# EAGLE schematic GB202-CC-from-SF-Base (EAGLE 7.5.0)
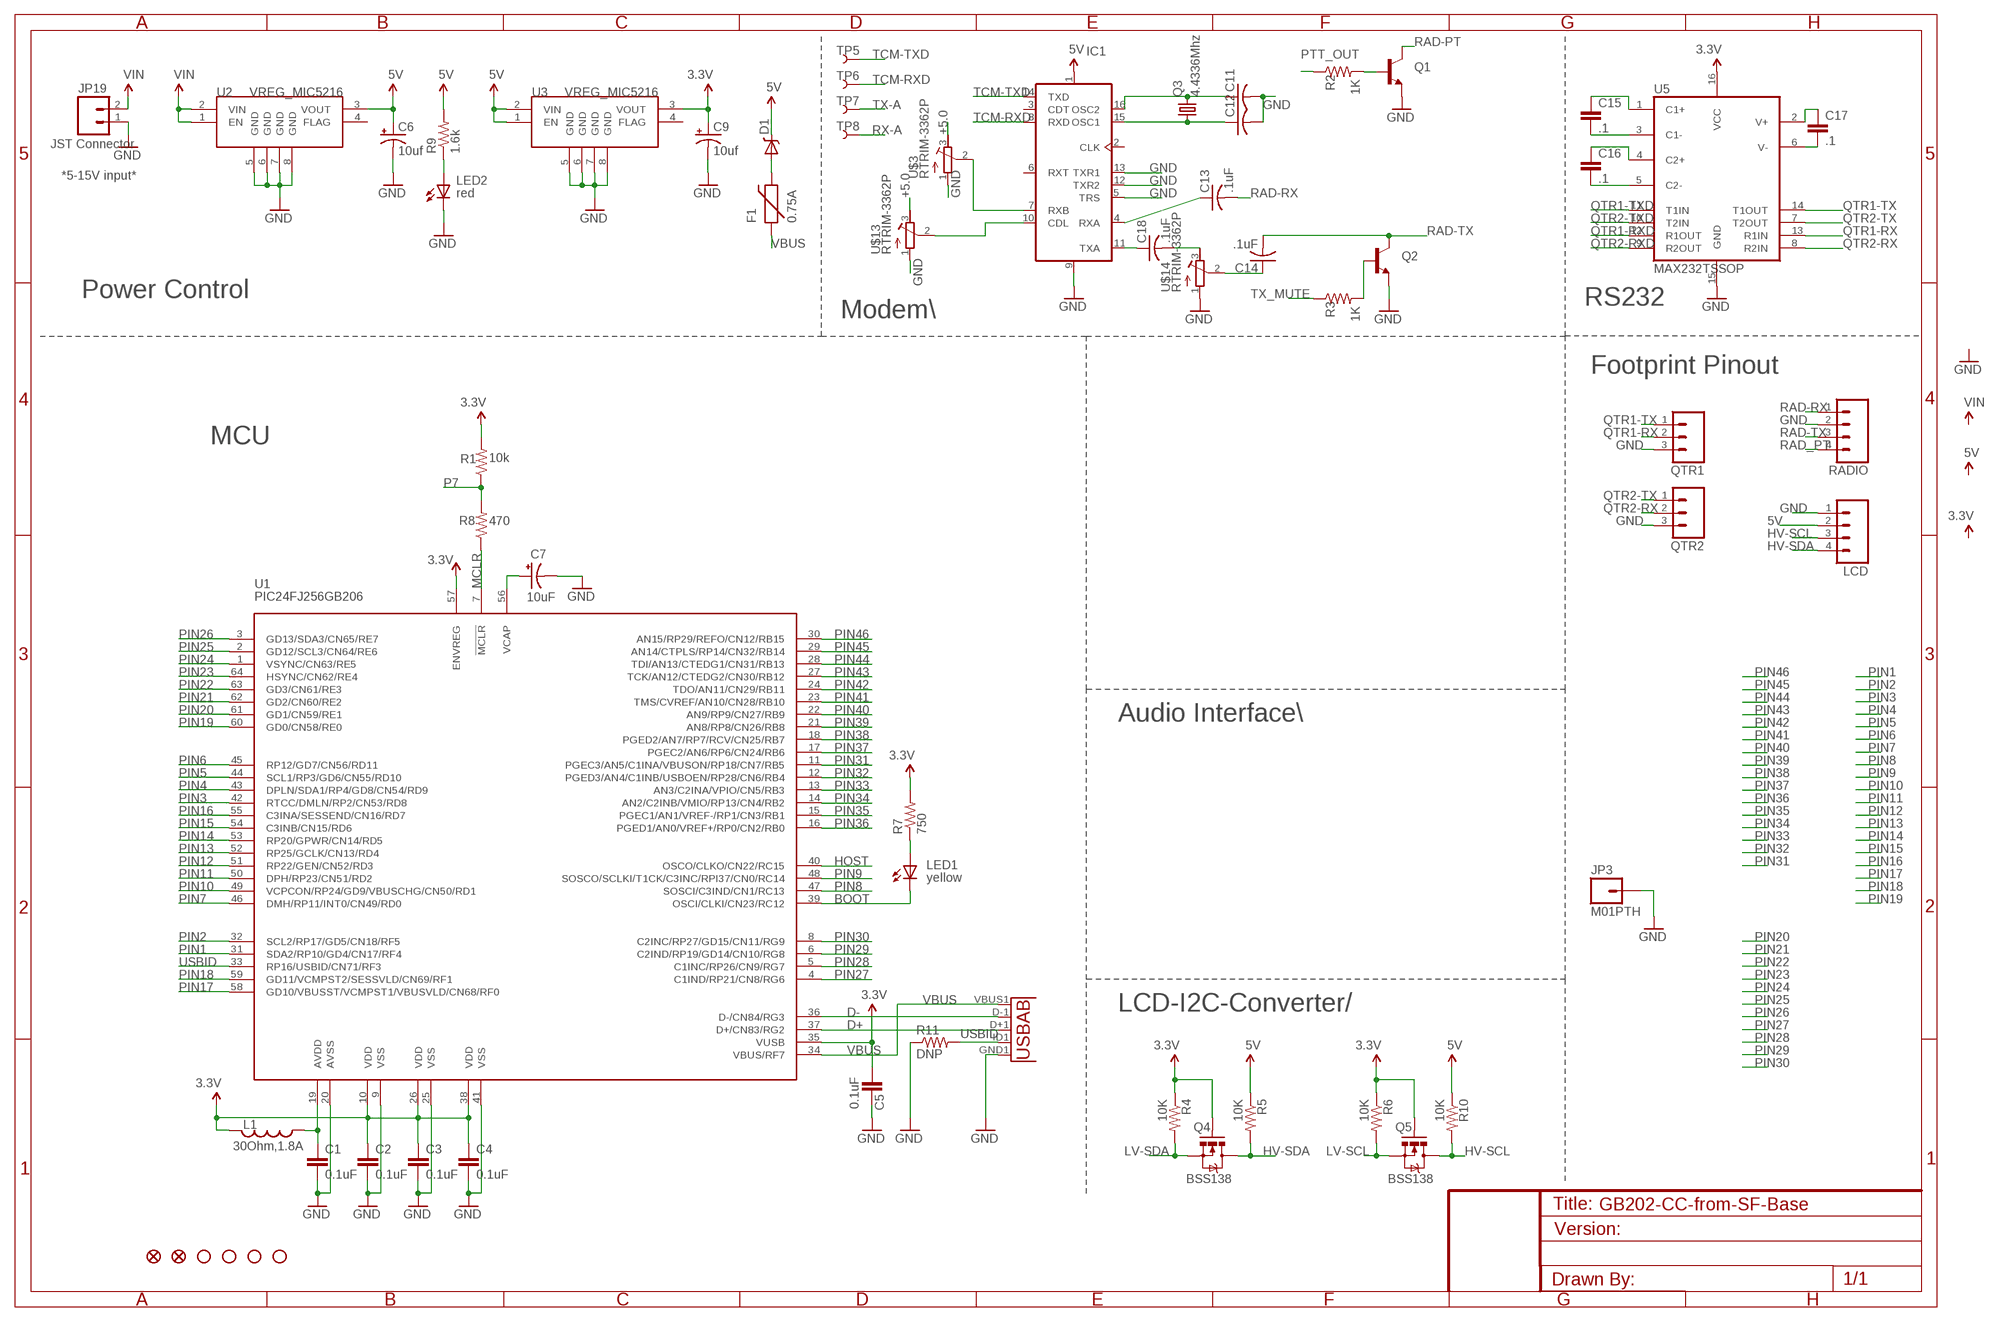
[diagram p0: schematic, sheet 1]

## Parts
C1  0.1uF  CAP0603-CAP  [0603-CAP]
C2  0.1uF  CAP0603-CAP  [0603-CAP]
C3  0.1uF  CAP0603-CAP  [0603-CAP]
C4  0.1uF  CAP0603-CAP  [0603-CAP]
C5  0.1uF  CAP0603-CAP  [0603-CAP]
C6  10uf  CAP_POL1206  [EIA3216]
C7  10uF  CAP_POL1206  [EIA3216]
C9  10uf  CAP_POL1206  [EIA3216]
C11  C-USC0603  [C0603]
C12  C-USC0603  [C0603]
C13  .1uF  C-USC0603  [C0603]
C14  .1uF  C-USC0603  [C0603]
C15  .1  CAPPTH  [CAP-PTH-SMALL]
C16  .1  CAPPTH  [CAP-PTH-SMALL]
C17  .1  CAPPTH  [CAP-PTH-SMALL]
C18  .1uF  C-USC0603  [C0603]
D1  DIODE-SCHOTTKY_  [SMA-DIODE]
F1  PTCSMD  [PTC-1206]
IC1  TCM3105  [DIL16]
JP3  M01PTH  [1X01]
JP8  FIDUCIALUFIDUCIAL  [MICRO-FIDUCIAL]
JP10  STAND-OFF  [STAND-OFF]
JP11  STAND-OFF  [STAND-OFF]
JP12  STAND-OFF  [STAND-OFF]
JP13  STAND-OFF  [STAND-OFF]
JP16  FIDUCIALUFIDUCIAL  [MICRO-FIDUCIAL]
JP19  JST Connector  M02-JST-2MM-SMT  [JST-2-SMD]
L1  30Ohm,1.8A  INDUCTOR0603  [0603]
LCD  M041X04_NO_SILK  [1X04_NO_SILK]
LED1  LY L29K-J1K2-26-Z  LED0603  [LED-0603]
LED2  LS L29K-G1J2-1-Z  LED0603  [LED-0603]
Q1  TRANSISTOR_NPN2N3904  [TO-92]
Q2  TRANSISTOR_NPN2N3904  [TO-92]
Q3  4.4336Mhz  CRYSTALHC49S  [HC49/S]
Q4  BSS138  MOSFET-NCHANNELSMD  [SOT23-3]
Q5  BSS138  MOSFET-NCHANNELSMD  [SOT23-3]
QTR1  M031X03_NO_SILK  [1X03_NO_SILK]
QTR2  M031X03_NO_SILK  [1X03_NO_SILK]
R1  10k  RESISTOR0603-RES  [0603-RES]
R2  1K  RESISTOR0603-RES  [0603-RES]
R3  1K  RESISTOR0603-RES  [0603-RES]
R4  10K  RESISTOR0603-RES  [0603-RES]
R5  10K  RESISTOR0603-RES  [0603-RES]
R6  10K  RESISTOR0603-RES  [0603-RES]
R7  750  RESISTOR0603-RES  [0603-RES]
R8  470  RESISTOR0603-RES  [0603-RES]
R9  1.6k  RESISTOR0603-RES  [0603-RES]
R10  10K  RESISTOR0603-RES  [0603-RES]
R11  DNP  RESISTOR0603-RES  [0603-RES]
RADIO  M041X04_NO_SILK  [1X04_NO_SILK]
TP5  TEST-POINT3  [PAD.03X.03]
TP6  TEST-POINT3  [PAD.03X.03]
TP7  TEST-POINT3  [PAD.03X.03]
TP8  TEST-POINT3  [PAD.03X.03]
U1  PIC24FJ256GB206  PIC24FXXXDAX06  [PIC24FXXX_TQFP64]
U2  VREG_MIC5216  [MSOP8]
U3  VREG_MIC5216  [MSOP8]
U4  USB-AB"""  [USB-AB-MICRO-SMD_V03]
U5  MAX232TSSOP  [TSSOP16]
U$3  RTRIM-3362P  [RTRIM3362P]
U$13  RTRIM-3362P  [RTRIM3362P]
U$14  RTRIM-3362P  [RTRIM3362P]

## Nets
3.3V: C2.1 C3.1 C4.1 C5.1 C9.A(+) L1.2 Q4.1(G) Q5.1(G) R1.2 R4.1 R6.1 R7.2 U1.10(VDD) U1.26(VDD) U1.35(VUSB) U1.38(VDD) U1.57(ENVREG) U3.3(VOUT) U5.16(VCC)
5V: C6.A(+) D1.C IC1.1(VDD) LCD.2 R5.1 R9.2 R10.1 U2.3(VOUT) U3.1(EN) U3.2(VIN)
+5.0: U$3.3 U$13.3
BOOT: LED1.C U1.39(OSCI/CLKI/CN23/RC12)
D+: U1.37(D+/CN83/RG2) U4.D+1(D+)
D-: U1.36(D-/CN84/RG3) U4.D-1(D-)
GND: C1.2 C2.2 C3.2 C4.2 C5.2 C6.C(-) C7.C(-) C9.C(-) C11.2 C12.2 IC1.5(TRS) IC1.9(VSS) IC1.12(TXR2) IC1.13(TXR1) JP3.1 JP19.1 LCD.1 LED2.C Q1.1(E) Q2.1(E) QTR1.3 QTR2.3 R11.1 RADIO.2 U1.9(VSS) U1.20(AVSS) U1.25(VSS) U1.41(VSS) U2.5(GND) U2.6(GND) U2.7(GND) U2.8(GND) U3.5(GND) U3.6(GND) U3.7(GND) U3.8(GND) U4.GND1(GND) U5.15(GND) U$3.1 U$13.1 U$14.1
HOST: U1.40(OSCO/CLKO/CN22/RC15)
HV-SCL: LCD.3 Q5.3(D) R10.2
HV-SDA: LCD.4 Q4.3(D) R5.2
LV-SCL: Q5.2(S) R6.2
LV-SDA: Q4.2(S) R4.2
MCLR: R8.1 U1.7(!MCLR)
N$1: Q1.2(B) R2.2
N$2: LED1.A R7.1
N$3: LED2.A R9.1
N$4: D1.A F1.2
N$5: C7.A(+) U1.56(VCAP)
N$6: Q2.2(B) R3.2
N$9: C1.1 L1.1 U1.19(AVDD)
N$10: C11.1 IC1.16(OSC2) Q3.2
N$11: C12.1 IC1.15(OSC1) Q3.1
N$12: C13.1 IC1.4(RXA)
N$13: C14.1 U$14.2
N$17: IC1.10(CDL) U$13.2
N$18: IC1.7(RXB) U$3.2
N$19: C18.1 IC1.11(TXA)
N$20: C18.2 U$14.3
N$23: C15.1 U5.1(C1+)
N$25: C15.2 U5.3(C1-)
N$26: C16.1 U5.4(C2+)
N$27: C16.2 U5.5(C2-)
N$28: C17.2 U5.6(V-)
N$29: C17.1 U5.2(V+)
P7: R1.1 R8.2
PIN1: U1.31(SDA2/RP10/GD4/CN17/RF4)
PIN2: U1.32(SCL2/RP17/GD5/CN18/RF5)
PIN3: U1.42(RTCC/DMLN/RP2/CN53/RD8)
PIN4: U1.43(DPLN/SDA1/RP4/GD8/CN54/RD9)
PIN5: U1.44(SCL1/RP3/GD6/CN55/RD10)
PIN6: U1.45(RP12/GD7/CN56/RD11)
PIN7: U1.46(DMH/RP11/INT0/CN49/RD0)
PIN8: U1.47(SOSCI/C3IND/CN1/RC13)
PIN9: U1.48(SOSCO/SCLKI/T1CK/C3INC/RPI37/CN0/RC14)
PIN10: U1.49(VCPCON/RP24/GD9/VBUSCHG/CN50/RD1)
PIN11: U1.50(DPH/RP23/CN51/RD2)
PIN12: U1.51(RP22/GEN/CN52/RD3)
PIN13: U1.52(RP25/GCLK/CN13/RD4)
PIN14: U1.53(RP20/GPWR/CN14/RD5)
PIN15: U1.54(C3INB/CN15/RD6)
PIN16: U1.55(C3INA/SESSEND/CN16/RD7)
PIN17: U1.58(GD10/VBUSST/VCMPST1/VBUSVLD/CN68/RF0)
PIN18: U1.59(GD11/VCMPST2/SESSVLD/CN69/RF1)
PIN19: U1.60(GD0/CN58/RE0)
PIN20: U1.61(GD1/CN59/RE1)
PIN21: U1.62(GD2/CN60/RE2)
PIN22: U1.63(GD3/CN61/RE3)
PIN23: U1.64(HSYNC/CN62/RE4)
PIN24: U1.1(VSYNC/CN63/RE5)
PIN25: U1.2(GD12/SCL3/CN64/RE6)
PIN26: U1.3(GD13/SDA3/CN65/RE7)
PIN27: U1.4(C1IND/RP21/CN8/RG6)
PIN28: U1.5(C1INC/RP26/CN9/RG7)
PIN29: U1.6(C2IND/RP19/GD14/CN10/RG8)
PIN30: U1.8(C2INC/RP27/GD15/CN11/RG9)
PIN31: U1.11(PGEC3/AN5/C1INA/VBUSON/RP18/CN7/RB5)
PIN32: U1.12(PGED3/AN4/C1INB/USBOEN/RP28/CN6/RB4)
PIN33: U1.13(AN3/C2INA/VPIO/CN5/RB3)
PIN34: U1.14(AN2/C2INB/VMIO/RP13/CN4/RB2)
PIN35: U1.15(PGEC1/AN1/VREF-/RP1/CN3/RB1)
PIN36: U1.16(PGED1/AN0/VREF+/RP0/CN2/RB0)
PIN37: U1.17(PGEC2/AN6/RP6/CN24/RB6)
PIN38: U1.18(PGED2/AN7/RP7/RCV/CN25/RB7)
PIN39: U1.21(AN8/RP8/CN26/RB8)
PIN40: U1.22(AN9/RP9/CN27/RB9)
PIN41: U1.23(TMS/CVREF/AN10/CN28/RB10)
PIN42: U1.24(TDO/AN11/CN29/RB11)
PIN43: U1.27(TCK/AN12/CTEDG2/CN30/RB12)
PIN44: U1.28(TDI/AN13/CTEDG1/CN31/RB13)
PIN45: U1.29(AN14/CTPLS/RP14/CN32/RB14)
PIN46: U1.30(AN15/RP29/REFO/CN12/RB15)
PTT_OUT: R2.1
QTR1-RX: QTR1.2 U5.13(R1IN)
QTR1-RXD: U5.12(R1OUT)
QTR1-TX: QTR1.1 U5.14(T1OUT)
QTR1-TXD: U5.11(T1IN)
QTR2-RX: QTR2.2 U5.8(R2IN)
QTR2-RXD: U5.9(R2OUT)
QTR2-TX: QTR2.1 U5.7(T2OUT)
QTR2-TXD: U5.10(T2IN)
RAD-PT: Q1.3(C)
RAD-RX: C13.2 RADIO.1
RAD-TX: Q2.3(C) RADIO.3
RAD_PT: RADIO.4
RX-A: TP8.P$1
TCM-RXD: IC1.8(RXD) TP6.P$1
TCM-TXD: IC1.14(TXD) TP5.P$1
TX-A: TP7.P$1
TX_MUTE: R3.1
USBID: R11.2 U1.33(RP16/USBID/CN71/RF3) U4.ID1(USBID)
VBUS: F1.1 U1.34(VBUS/RF7) U4.VBUS1(VBUS)
VIN: JP19.2 U2.1(EN) U2.2(VIN)
Unconnected: C14.2 IC1.2(CLK) IC1.3(CDT) IC1.6(RXT) U2.4(FLAG) U3.4(FLAG)

## Notes on the sheet
- *5-15V input*
- red
- 0.75A
- Power Control
- RS232
- Modem\
- Footprint Pinout
- MCU
- Audio Interface\
- yellow
- LCD-I2C-Converter/

## Library data of the parts
C1-C5 C15-C17 = SparkFun-Capacitors:CAP: Capacitor Standard 0603 ceramic capacitor, and 0.1" leaded capacitor.
C6 C9 = SparkFun-Capacitors:CAP_POL: Capacitor Polarized These are standard SMD and PTH capacitors. Normally 10uF, 47uF, and 100uF in electrolytic and tantalum varieties. Always verify the external diameter of the through hole cap, it varies with capacity, voltage, and manufacturer. The EIA devices should be standard.
C7 = SparkFun:CAP_POL: Capacitor Polarized These are standard SMD and PTH capacitors. Normally 10uF, 47uF, and 100uF in electrolytic and tantalum varieties. Always verify the external diameter of the through hole cap, it varies with capacity, voltage, and manufacturer. The EIA devices should be standard.
C11-C14 C18 = rcl:C-US: CAPACITOR, American symbol
D1 = SparkFun-DiscreteSemi:DIODE-SCHOTTKY: Commonly MBRA140.
F1 = SparkFun-PowerIC:PTC: Resettable Fuse PTC Resettable Fuse. Spark Fun Electronics SKU : COM-08357
IC1 = tcm3105:TCM3105
JP3 = SparkFun:M01: Header 1 Standard 1-pin 0.1" header. Use with straight break away headers (SKU : PRT-00116), right angle break away headers (PRT-00553), swiss pins (PRT-00743), machine pins (PRT-00117), and female headers (PRT-00115).
JP8 JP16 = SparkFun:FIDUCIAL: Fiducial Alignment Points Various fiducial points for machine vision alignment.
JP10-JP13 = SparkFun:STAND-OFF: Stand Off This is the mechanical footprint for a #4 phillips button head screw. Use the keepout ring to avoid running the screw head into surrounding components. SKU : PRT-00447
JP19 = SparkFun:M02: Header 2 Standard 2-pin 0.1" header. Use with straight break away headers (SKU : PRT-00116), right angle break away headers (PRT-00553), swiss pins (PRT-00743), machine pins (PRT-00117), and female headers (PRT-00115). Molex polarized connector foot print use with SKU : PRT-08233 with associated crimp pins and housings.
L1 = SparkFun-Passives:INDUCTOR: Inductors Basic Inductor/Choke - 0603 and 1206. Footprints are not proven and vary greatly between part numbers. SRN6045- 33uH, 20% 1.4A
LCD RADIO = SparkFun-Connectors:M04: Header 4 Standard 4-pin 0.1" header. Use with straight break away headers (SKU : PRT-00116), right angle break away headers (PRT-00553), swiss pins (PRT-00743), machine pins (PRT-00117), and female headers (PRT-00115). Molex polarized connector foot print use with SKU : PRT-08231 with associated crimp pins and housings. 1MM SMD Version SKU: PRT-10208; PROD_ID: CONN-09696
LED1 = SparkFun-LED:LED: LEDs Standard schematic elements and footprints for 5mm, 3mm, 1206, and 0603 sized LEDs. 5mm - Spark Fun Electronics SKU : COM-00529 (and others)
LED2 = SparkFun:LED: LEDs Standard schematic elements and footprints for 5mm, 3mm, 1206, and 0603 sized LEDs. 5mm - Spark Fun Electronics SKU : COM-00529 (and others)
Q1 Q2 = SparkFun-DiscreteSemi:TRANSISTOR_NPN: Generic NPN BJT MMBT2222A - TRANS-08049 (SOT-23, 1A 40V) MPSA42 - TRANS-09116 (SOT-23, 500mA 300V) MMBT5088LT1G - TRANS-11160 (SOT-23, 50 mA 30V) BC547 - COM-08928 <http://www.sparkfun.com/products/8928> (TO-92 45V 100mA) (1.Collector 2.Base 3.Emitter) 2N3904 - COM-00521 <http://www.sparkfun.com/products/521> (TO-92 40V 200mA) (1.Emitter 2.Base 3.Collector) P2N2222A - COM-12852 <http://www.sparkfun.com/products/12852> (TO-92 40V 600mA) (1.Collector 2.Base 3.Emitter); PROD_ID: TRANS-08447
Q3 = crystal:CRYSTAL: CRYSTAL; OC_FARNELL: 1667008; OC_NEWARK: unknown
Q4 Q5 = SparkFun:MOSFET-NCHANNEL
QTR1 QTR2 = SparkFun-Connectors:M03: Header 3 Standard 3-pin 0.1" header. Use with straight break away headers (SKU : PRT-00116), right angle break away headers (PRT-00553), swiss pins (PRT-00743), machine pins (PRT-00117), and female headers (PRT-00115). Molex polarized connector foot print use with SKU : PRT-08232 with associated crimp pins and housings.
R1-R3 R7-R9 = SparkFun-Resistors:RESISTOR: Resistor Basic schematic elements and footprints for 0603, 1206, and PTH resistors.
R4-R6 R10 R11 = SparkFun:RESISTOR: Resistor Basic schematic elements and footprints for 0603, 1206, and PTH resistors.
TP5-TP8 = SparkFun-Passives:TEST-POINT: Bare copper test points for troubleshooting or ICT
U1 = SparkFun-DigitalIC:PIC24FXXXDAX06: PIC24FXXXDAX06 PIC24FXXXDA106 / PIC24FXXXDA206
U2 U3 = SparkFun-PowerIC:VREG_MIC5216: 500mA LDO, MSOP8 for better dissipation
U4 = Testing:USB-AB: This is a USB AB connector that is compatible with USB OTG. i.e. this connector can serve as a host or device
U5 = SparkFun-DigitalIC:MAX232: RS232 Transceiver Very common IC. This is generically called 'MAX232', but works with the 3V equivalent MAX3232 generic ICs. Field tested and mother approved. Spark Fun Electronics SKU : COM-00316 (DIP) and COM-00589 (SMD)
U$3 U$13 U$14 = GeekAmmo:RTRIM: BOURNS 3362 - 1/4" Square Trimpot® Trimming Potentiometer